# Altium schematic sheet [1] PSU.SchDoc
size A4
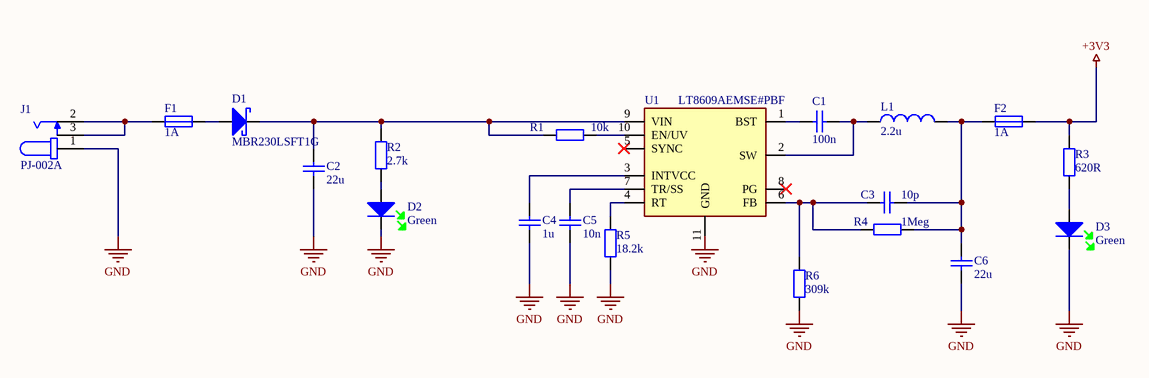
[diagram p0: [1] PSU.SchDoc]

## Parts
C1  100n  [Capacitor 0603]
C2  22u  [Capacitor 0603]
C3  10p  [Capacitor 0603]
C4  1u  [Capacitor 0603]
C5  10n  [Capacitor 0603]
C6  22u  [Capacitor 0603]
D1  MBR230LSFT1G  [Diode SOD123f]
D2  Green  [LED 0805 Green]
D3  Green  [LED 0805 Green]
F1  1A  [Fuse 1206]
F2  1A  [Fuse 1206]
J1  PJ-002A  [Mechanical CUI_PJ-002A]
L1  2.2u  [Inductor XAL50xx]
R1  10k  [Resistor 0603]
R2  2.7k  [Resistor 0603]
R3  620R  [Resistor 0603]
R4  1Meg  [Resistor 0603]
R5  18.2k  [Resistor 0603]
R6  309k  [Resistor 0603]
U1  LT8609AEMSE#PBF  [MSOP-10]

## Nets
+3V3: F2.2 R3.2
GND: C2.1 C4.1 C5.1 C6.1 D2.1 D3.1 J1.1 R5.1 R6.1 U1.11(GND)
NetC1_1: C1.1 U1.1(BST)
NetC1_2: C1.2 L1.1 U1.2(SW)
NetC2_2: C2.2 D1.2 R1.1 R2.2 U1.9(VIN)
NetC3_1: C3.1 R4.1 R6.2 U1.6(FB)
NetC3_2: C3.2 C6.2 F2.1 L1.2 R4.2
NetC4_2: C4.2 U1.3(INTVCC)
NetC5_2: C5.2 U1.7(TR/SS)
NetD1_1: D1.1 F1.2
NetD2_2: D2.2 R2.1
NetD3_2: D3.2 R3.1
NetF1_1: F1.1 J1.2 J1.3
NetR1_2: R1.2 U1.10(EN/UV)
NetR5_2: R5.2 U1.4(RT)

Not connected (* = marked no-connect by the designer): U1 5(SYNC)* 8(PG)*

## Library data of the parts
C1 = Capacitor 100n 10% 0603 EMK107B7104KA-T: Multilayer Ceramic Capacitors MLCC - SMD/SMT 0603 16VDC 0.1uF 10% X7R; Manufacturer: Taiyo Yuden; Type: SMD; Manufacturer Part Number: EMK107B7104KA-T; Footprint: 0603; Datasheet: https://pl.mouser.com/datasheet/2/396/mlcc02_e-1307760.pdf
C2 C6 = Capacitor 22u 10% 0603 CL10A226MO7JZNC: Multilayer Ceramic Capacitors MLCC - SMD/SMT 22uF+/-20% 16V X5R 1608; Manufacturer: Samsung Electro-Mechanics; Type: SMD; Manufacturer Part Number: CL10A226MO7JZNC; Footprint: 0603; Datasheet: https://pl.mouser.com/datasheet/2/585/MLCC-1837944.pdf
C3 = Capacitor 10p 10% 0603 0603YC100KAT2A: Multilayer Ceramic Capacitors MLCC - SMD/SMT 16V 10pF X7R 0603 10%; Manufacturer: AVX; Type: SMD; Manufacturer Part Number: 0603YC100KAT2A; Footprint: 0603; Datasheet: https://pl.mouser.com/datasheet/2/40/X7RDielectric-777024.pdf
C4 = Capacitor 1u 10% 0603 EMK107B7105KA-T: Multilayer Ceramic Capacitors MLCC - SMD/SMT 0603 16VDC 1uF 10% X7R; Manufacturer: Taiyo Yuden; Type: SMD; Manufacturer Part Number: EMK107B7105KA-T; Footprint: 0603; Datasheet: https://pl.mouser.com/datasheet/2/396/mlcc02_e-1307760.pdf
C5 = Capacitor 10n 10% 0603 EMK107SD103KA-T: Multilayer Ceramic Capacitors MLCC - SMD/SMT 0603 16VDC 10nF 10% Low Distort; Manufacturer: Taiyo Yuden; Type: SMD; Manufacturer Part Number: EMK107SD103KA-T; Footprint: 0603; Datasheet: https://pl.mouser.com/datasheet/2/396/mlcc02_e-1307760.pdf
D1 = Diode Schottky Diodes2A 30V SCHOTTKY MBR230LSFT1G: Schottky Diodes & Rectifiers 2A 30V SCHOTTKY; Manufacturer: ON Semiconductor / Fairchild; Type: SMD; Manufacturer Part Number: MBR230LSFT1G; Footprint: SOD-123FL-2; Datasheet: https://pl.mouser.com/datasheet/2/308/MBR230LSFT1_D-1811015.pdf
D2 D3 = Diode Standard LEDs - SMD 0805 Dome Lens LED Green- 570nm APTD2012LCGCK: Standard LEDs - SMD 0805 Dome Lens LED Green- 570nm; Manufacturer: Kingbright; Manufacturer Part Number: APTD2012LCGCK; Footprint: 0805; Type: SMD; Datasheet: https://pl.mouser.com/datasheet/2/216/APTD2012LCGCK-1102037.pdf
F1 F2 = Fuse 1206 SMT Fuse Fast Acting, 1A: Surface Mount Fuses 1206 SMT Fuse Fast Acting, 1A; Manufacturer Part Number: C1F 1; Manufacturer: Bel Fuse; Type: SMD; Footprint: 1206; Datasheet: https://pl.mouser.com/datasheet/2/643/ds-CP-c1f-series-1313112.pdf
J1 = Mechanical DC Power Connectors Power Jacks: DC Power Connectors Power Jacks; Manufacturer Part Number: PJ-002A; Manufacturer: https://pl.mouser.com/datasheet/2/670/pj_002a-1778764.pdf; Footprint: 2 mm x 6.5 mm; Type: THT; Datasheet: https://pl.mouser.com/datasheet/2/670/pj_002a-1778764.pdf
L1 = Inductor Fixed Inductors 2.2uH Shld 20% 9.2A 14.5mOhms AECQ2: Fixed Inductors 2.2uH Shld 20% 9.2A 14.5mOhms AECQ2; Manufacturer Part Number: XAL5030-222MEB; Manufacturer: Coilcraft; Type: SMD; Footprint: 5.28 mm x 3.1 mm x 5.48 mm; Datasheet: https://pl.mouser.com/datasheet/2/597/xal50xx-270657.pdf
R1 = Resistor 10k 1% 0603 RT0603FRE0710KL: Thin Film Resistors - SMD 10K ohm 1% 1/10W; Manufacturer: Yageo; Manufacturer Part Number: RT0603FRE0710KL; Footprint: 0603; Type: SMD; Datasheet: https://pl.mouser.com/datasheet/2/447/PYu_RT_1_to_0_01_RoHS_L_11-1669912.pdf
R2 = Resistor 2.7k 1% 0603 RT0603FRE072K7L: Thin Film Resistors - SMD 1/10W 2.7K ohm 1% 50ppm; Manufacturer: Yageo; Manufacturer Part Number: RT0603FRE072K7L; Footprint: 0603; Type: SMD; Datasheet: https://pl.mouser.com/datasheet/2/447/PYu_RT_1_to_0_01_RoHS_L_11-1669912.pdf
R3 = Resistor 620R 1% 0603 RT0603FRE07620RL: Thin Film Resistors - SMD 620 OHM 1% 50PPM 1/10W; Manufacturer: Yageo; Manufacturer Part Number: RT0603FRE07620RL; Footprint: 0603; Type: SMD; Datasheet: https://pl.mouser.com/datasheet/2/447/PYu_RT_1_to_0_01_RoHS_L_11-1669912.pdf
R4 = Resistor 1Meg 1% 0603 RT0603FRE071ML: Thin Film Resistors - SMD 1M OHM 1% 50PPM 1/10W; Manufacturer: Yageo; Manufacturer Part Number: RT0603FRE071ML; Footprint: 0603; Type: SMD; Datasheet: https://pl.mouser.com/datasheet/2/447/PYu_RT_1_to_0_01_RoHS_L_11-1669912.pdf
R5 = Resistor 18.2k 1% 0603 RT0603FRE0718K2L: Thin Film Resistors - SMD 1/10W 18.2K ohm 1% 50ppm; Manufacturer: Yageo; Manufacturer Part Number: RT0603FRE0718K2L; Footprint: 0603; Type: SMD; Datasheet: https://pl.mouser.com/datasheet/2/447/PYu_RT_1_to_0_01_RoHS_L_11-1669912.pdf
R6 = Resistor 309k 1% 0603 RT0603FRE07309KL: Thin Film Resistors - SMD 1/10W 309K ohm 1% 50ppm; Manufacturer: Yageo; Manufacturer Part Number: RT0603FRE07309KL; Footprint: 0603; Type: SMD; Datasheet: https://pl.mouser.com/datasheet/2/447/PYu_RT_1_to_0_01_RoHS_L_11-1669912.pdf
U1 = IC Switching Voltage Regulators 42V, 2A/3A Peak Sync Buck Reg w/ 2.5uA LT8609AEMSE#PBF: Switching Voltage Regulators 42V, 2A Synchronous Step-Down Regulator with 2.5uA Quiescent Current; Manufacturer: Analog Devices; Manufacturer Part Number: LT8609AEMSE#PBF; Type: SMD; Datasheet: https://pl.mouser.com/datasheet/2/609/LT8609_8609A_8609B-1551398.pdf